# Altium schematic sheet Power Management.SchDoc
size A4; SheetNumber: 6; SheetTotal: 11
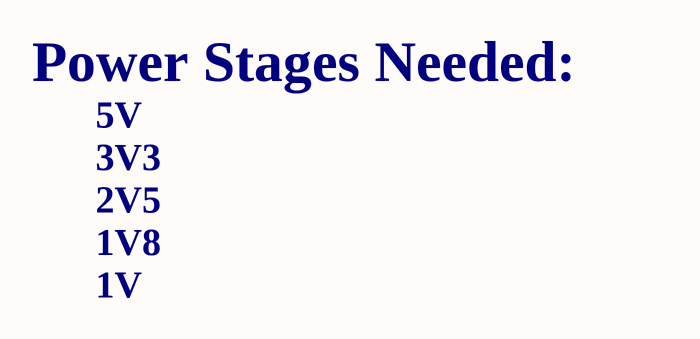
[diagram p0: Power Management.SchDoc]

## Notes on the sheet
- Power Stages Needed:
- 5V
- 3V3
- 2V5
- 1V8
- 1V